# EAGLE design usb-wifi-adapter-box (EAGLE 6.4)
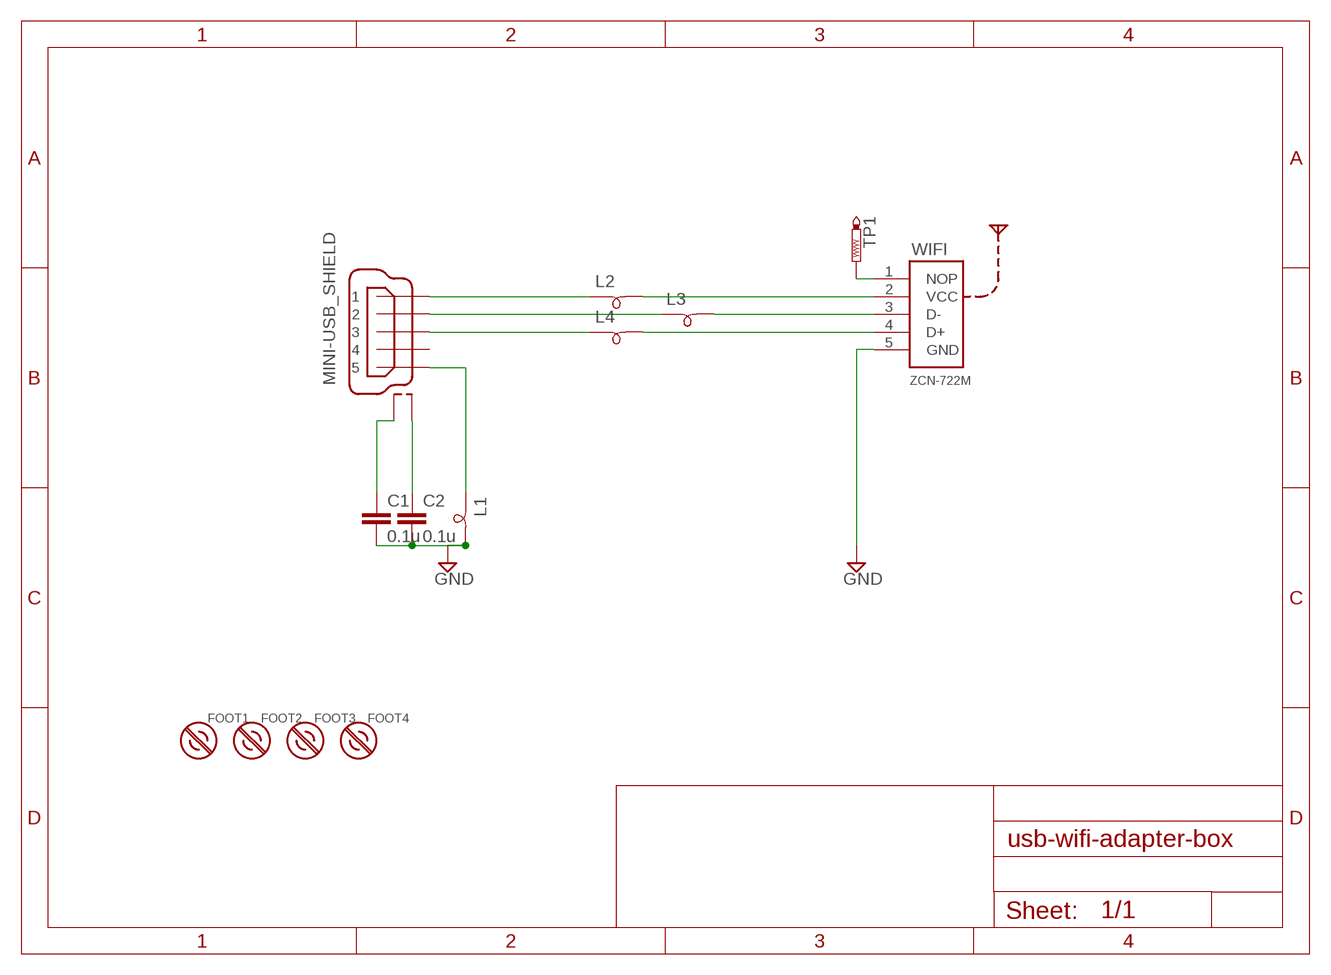
[diagram p0: schematic, sheet 1]

## Parts
C1  0.1u  C-EUC0805  [C0805]
C2  0.1u  C-EUC0805  [C0805]
CONN1  MINI-USB_SHIELD  [RUGGEDUSB]
FOOT1  _4-BARE_MOUNTING_HOLE/.400  [_4/.400-BARE+STD_TOOL_CLEARANCE]
FOOT2  _4-BARE_MOUNTING_HOLE/.400  [_4/.400-BARE+STD_TOOL_CLEARANCE]
FOOT3  _4-BARE_MOUNTING_HOLE/.400  [_4/.400-BARE+STD_TOOL_CLEARANCE]
FOOT4  _4-BARE_MOUNTING_HOLE/.400  [_4/.400-BARE+STD_TOOL_CLEARANCE]
L1  INDUCTOR-BEAD  [R0805]
L2  INDUCTOR-BEAD  [R0805]
L3  INDUCTOR-BEAD  [R0805]
L4  INDUCTOR-BEAD  [R0805]
TP1  PTR1PAD1-13  [P1-13]
WIFI  ZCN-722M  [ZCN-722M]

## Nets
D+: L4.2 WIFI.4(D+)
D+OUT: CONN1.3 L4.1
D-: L3.2 WIFI.3(D-)
D-OUT: CONN1.2 L3.1
GND: C1.2 C2.2 L1.2 WIFI.5(GND)
GNDOUT: CONN1.5 L1.1
N$1: TP1.TP WIFI.1(NOP)
SHEILDGND1: C2.1 CONN1.SHLD@2(S:S2)
SHIELDGND2: C1.1 CONN1.SHLD@1(S:S1)
VCC: L2.2 WIFI.2(VCC)
VCC_OUT: CONN1.1 L2.1
Unconnected: CONN1.4

## Library data of the parts
C1 C2 = rcl:C-EU: CAPACITOR, European symbol
CONN1 = dxwifi:MINI-USB_SHIELD: USB Mini B MUSBB15134
FOOT1-FOOT4 = mount-2:_4-BARE_MOUNTING_HOLE: 1/8" drill hole for #4 screw mount
L1-L4 = dxwifi:INDUCTOR-BEAD: INDUCTOR SMD Bead inductor
TP1 = testpad:PTR1: TEST PIN
WIFI = dxwifi:ZCN-722M: ZCN-722M USB WiFi Module High-speed Wireless-N (802.11n draft 5.0 ) networking Comply with IEEE802.11b/g

## Board
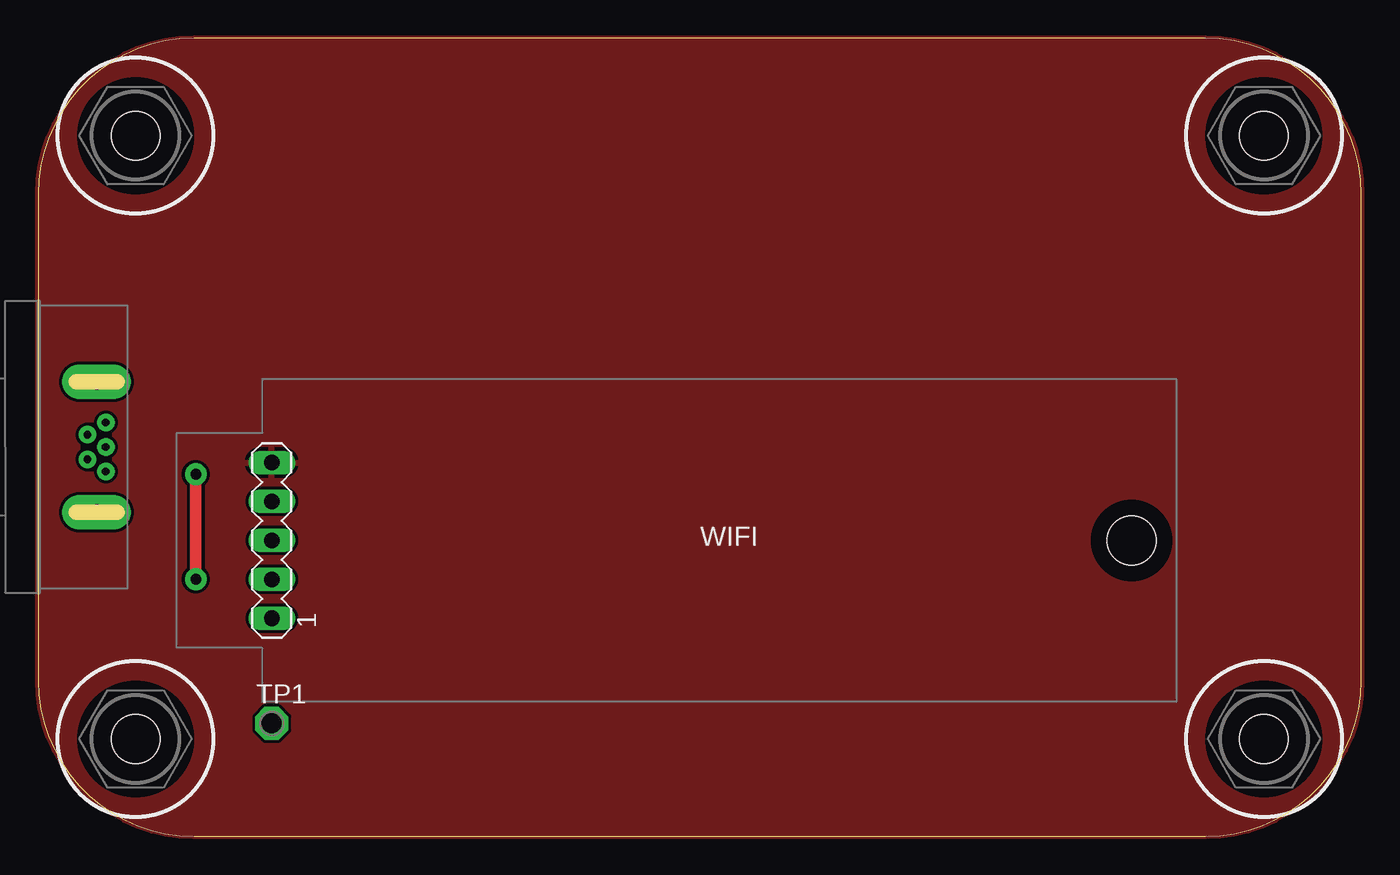
[diagram p1: board, top side]
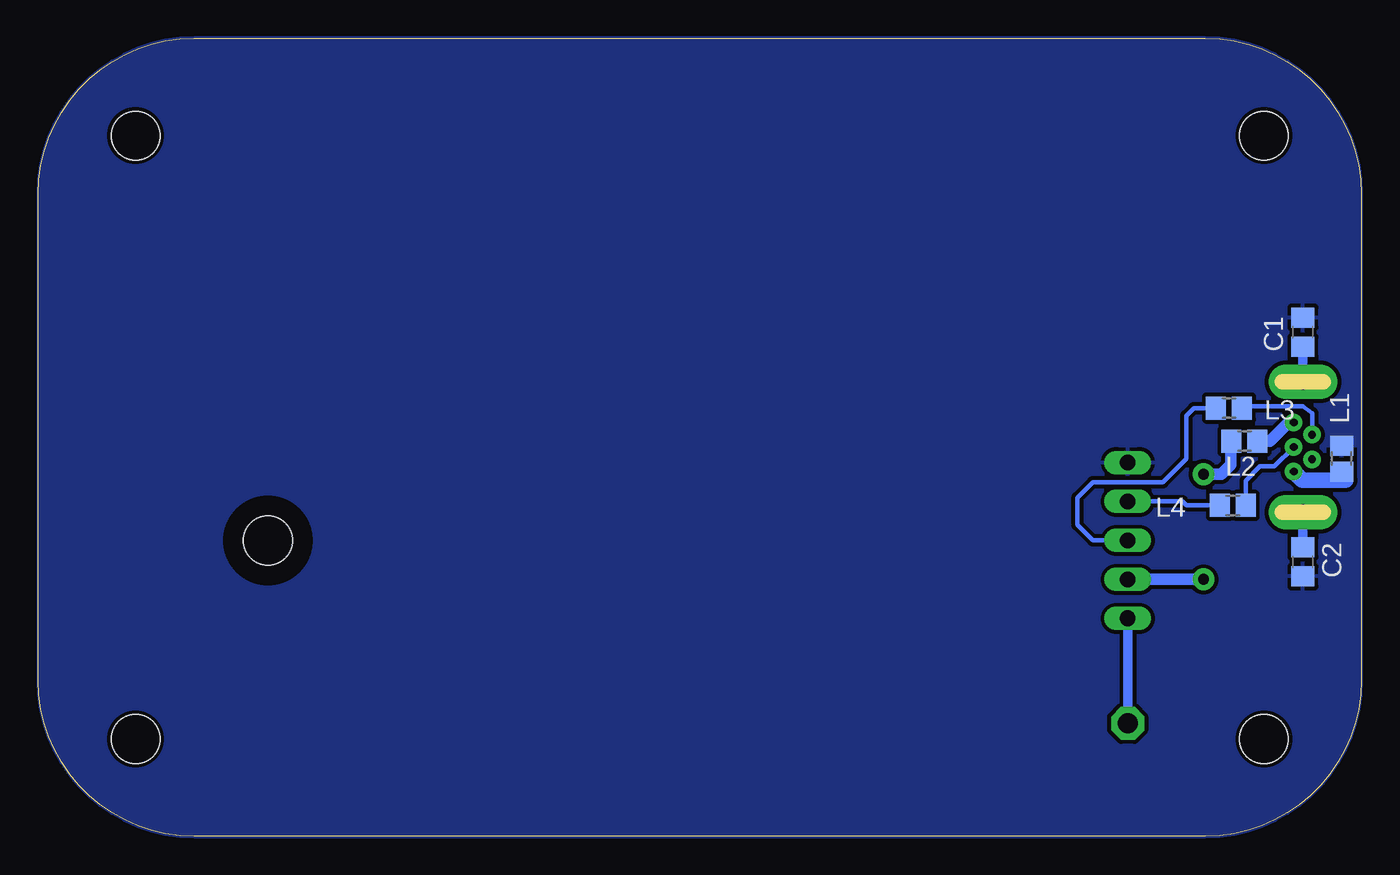
[diagram p2: board, bottom side, seen from below]

Size 86.36 x 52.07 mm. Coordinates in mm from the lower left corner, seen from the top.
Outline: 10.16,0 76.2,0 arc90 86.36,10.16 86.36,41.91 arc90 76.2,52.07 10.16,52.07 arc90 0,41.91 0,10.16 arc90 10.16,0
Copper layers (1*16): Top 0.0178mm / dielectric 59mil / Bottom 0.0178mm
Design rules "epl-lpkf *": minimum track width 8mil, minimum drill 0.35mm, track to track 8mil, track to pad 8mil, pad to pad 8mil, via to via 8mil, smd to smd 8mil, copper to edge 0mil, drill to drill 15mil, minimum pad ring 8mil, minimum via ring 8mil, stop-mask expansion 3mil, vias tented up to drill 0mil, thermal gap 10mil

### Footprints (pad centres in the part's own frame; a part is rotated, then mirrored left to right if it is on the bottom)
C0805 = smd 1.3 x 1.5: 1 -0.95,0; 2 0.95,0
RUGGEDUSB = drill 0.508 pad 1.143: 1 -1.6,0.6; 2 -0.8,-0.6; 3 0,0.6; 4 0.8,-0.6; 5 1.6,0.6 | drill 1 pad 2.25 long: SHLD@1 -4.25,0; SHLD@2 4.25,0
_4/.400-BARE+STD_TOOL_CLEARANCE = hole 3.175: 0,0
R0805 = smd 1.3 x 1.5: 1 -0.85,0; 2 0.85,0
P1-13 = drill 1.321 pad 2.159 octagon: TP 0,0
ZCN-722M = drill 1.016 long: 1 -29.21,-5.08; 2 -29.21,-2.54; 3 -29.21,0; 4 -29.21,2.54; 5 -29.21,5.08 | hole 3.175: 26.924,0

### Placement (x,y rotation side)
C1  3.81,32.89 90 bottom
C2  3.81,17.91 270 bottom
CONN1  3.81,25.4 270 top
FOOT1  6.35,45.72 0 top
FOOT2  6.35,6.35 0 top
FOOT3  80.01,6.35 0 top
FOOT4  80.01,45.72 0 top
L1  1.27,24.64 90 bottom
L2  7.62,25.78 180 bottom
L3  8.64,27.94 180 bottom
L4  8.38,21.59 180 bottom
TP1  15.24,7.37 0 top
WIFI  44.45,19.3 0 top

### Tracks (layer width: path | path; a pad name or v marks a point on that pad's centre or on a via)
D+
  Bottom 0.305: L4.2 11.43,21.59 11.68,21.84 WIFI.4
D+OUT
  Bottom 0.305: CONN1.3 5.68,24.13 6.6,24.13 7.53,23.2 L4.1
D-
  Bottom 0.305: L3.2 10.92,27.94 11.43,27.43 11.43,24.64 12.95,23.11 17.53,23.11 18.54,22.1 18.54,20.32 17.53,19.3 WIFI.3
D-OUT
  Bottom 0.305: CONN1.2 3.21,27.59 3.81,28.07 7.75,28.07 L3.1
GND
  pour Bottom (isolate 0.254): 0,41.91 arc-90 10.16,52.07 76.2,52.07 arc-90 86.36,41.91 86.36,10.16 arc-90 76.2,0 10.16,0 arc-90 0,10.16
  pour Top: 0,41.91 arc-90 10.16,52.07 76.2,52.07 arc-90 86.36,41.91 86.36,10.16 arc-90 76.2,0 10.16,0 arc-90 0,10.16
  pour Bottom (isolate 0.254, no thermals): 0,25.4 2.54,25.4 2.54,27.94 0,27.94
GNDOUT
  Bottom 1.016: CONN1.5 3.85,23.24 1.02,23.24 1.27,23.5 L1.1
N$1
  Bottom 0.61: WIFI.1 TP1.TP
SHEILDGND1
  Bottom 0.61: C2.1 CONN1.SHLD@2
SHIELDGND2
  Bottom 0.61: C1.1 CONN1.SHLD@1
VCC  (via drill 0.7 pad 1.42)
  Top 0.762: v10.29,23.62 v10.29,16.76
  Bottom 0.762: L2.2 8.51,25.74 8.51,24.26 9.14,23.62 v10.29,23.62 | v10.29,16.76 WIFI.2
VCC_OUT
  Bottom 0.762: CONN1.1 4.49,26.92 4.83,26.92 5.97,25.78 L2.1

### Text on the board
Measures: Dimentions of Altoid box